# EAGLE schematic n64rgbv1 (EAGLE 8.5.0)
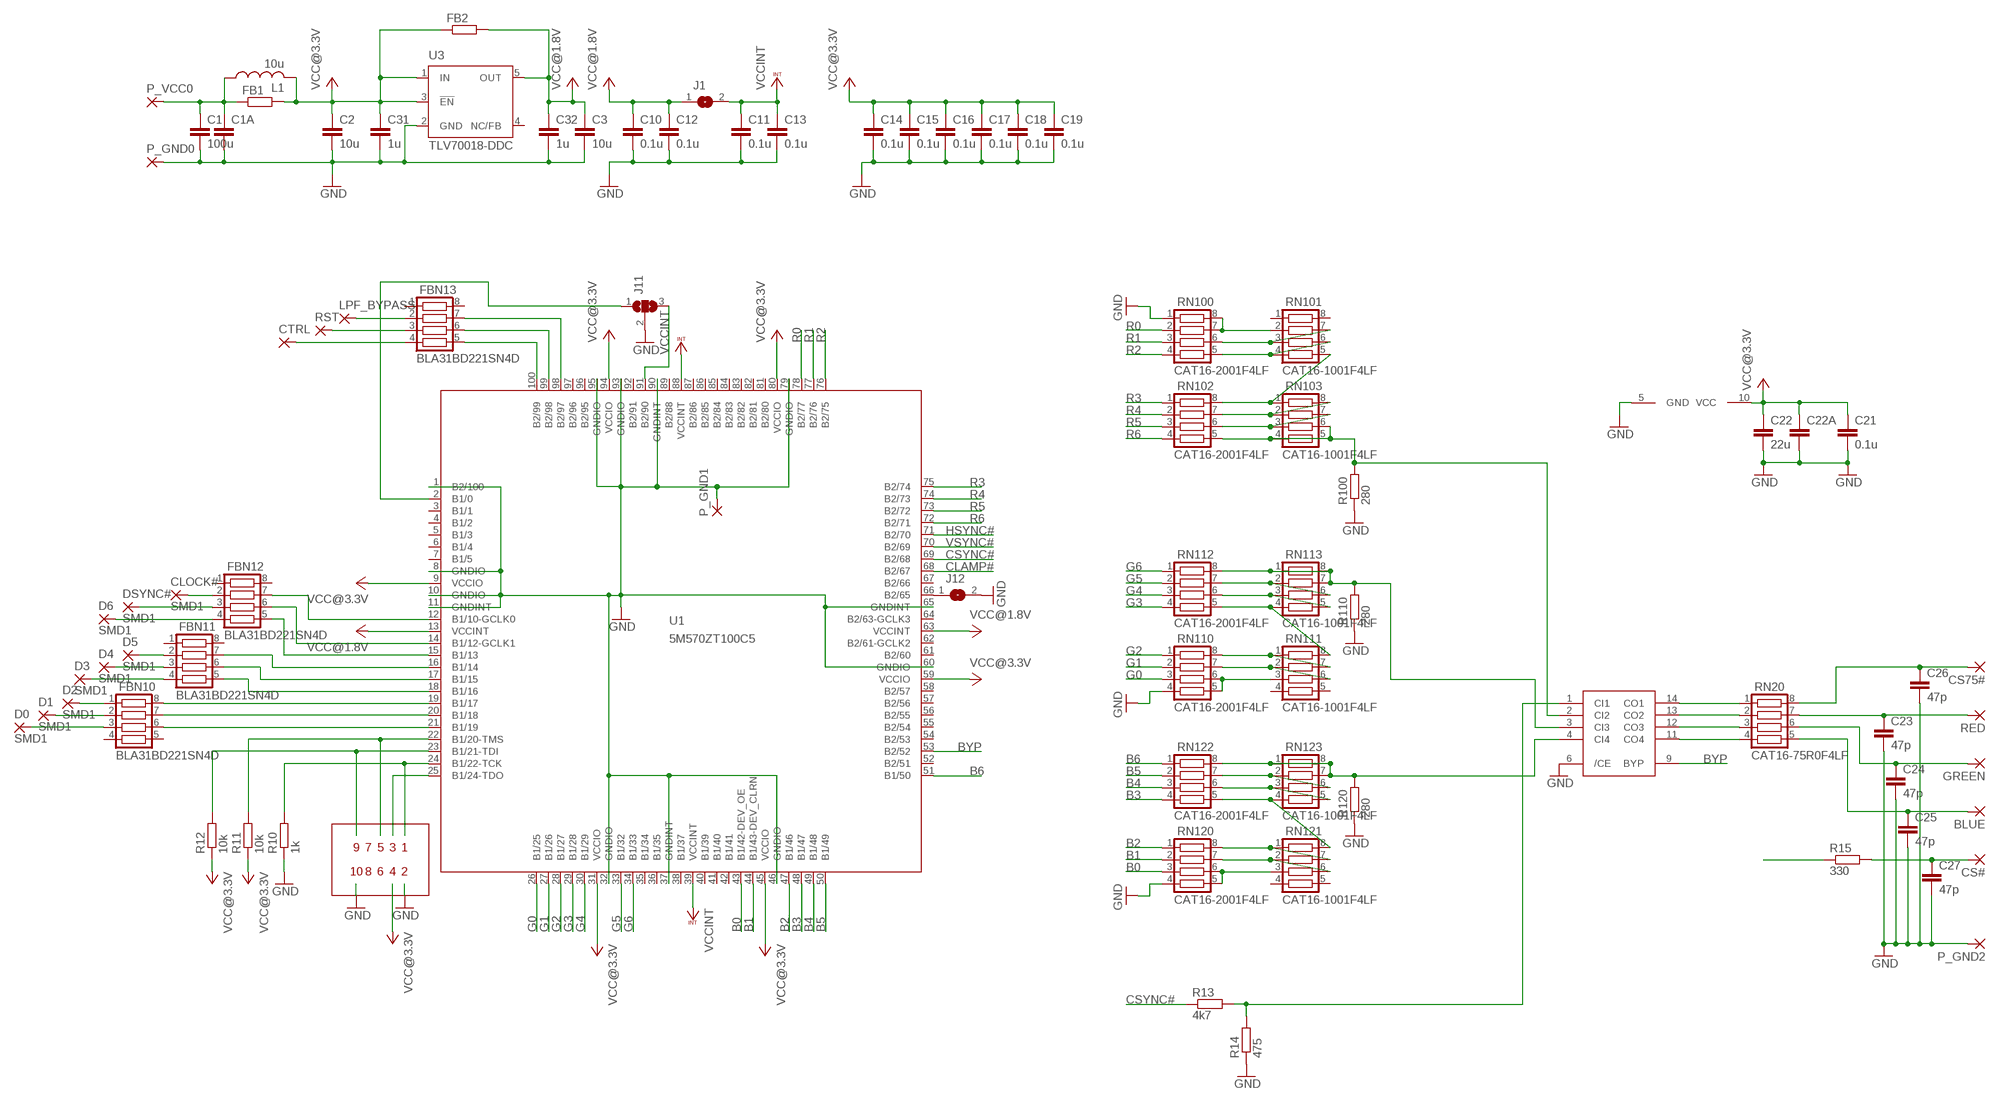
[diagram p0: schematic, sheet 1]

## Parts
BLUE  SMD2  [SMD1,27-2,54]
C1  100u  C-EUC1206K  [C1206K]
C1A  C-EUC0805  [C0805]
C2  10u  C-EUC0805  [C0805]
C3  10u  C-EUC0805  [C0805]
C10  0.1u  C-EUC0603  [C0603]
C11  0.1u  C-EUC0603  [C0603]
C12  0.1u  C-EUC0603  [C0603]
C13  0.1u  C-EUC0603  [C0603]
C14  0.1u  C-EUC0603  [C0603]
C15  0.1u  C-EUC0603  [C0603]
C16  0.1u  C-EUC0603  [C0603]
C17  0.1u  C-EUC0603  [C0603]
C18  0.1u  C-EUC0603  [C0603]
C19  0.1u  C-EUC0603  [C0603]
C21  0.1u  C-EUC0603  [C0603]
C22  22u  C-EUC1206K  [C1206K]
C22A  C-EUC0805  [C0805]
C23  47p  C-EUC0603  [C0603]
C24  47p  C-EUC0603  [C0603]
C25  47p  C-EUC0603  [C0603]
C26  47p  C-EUC0603  [C0603]
C27  47p  C-EUC0603  [C0603]
C31  1u  C-EUC0603  [C0603]
C32  1u  C-EUC0603  [C0603]
CLOCK#  SMD1  [SMD0,8-1,6]
CS75#  SMD2  [SMD1,27-2,54]
CS#  SMD2  [SMD1,27-2,54]
CTRL  SMD2  [SMD1,27-2,54]
D0  SMD1  [SMD0,8-1,6]
D1  SMD1  [SMD0,8-1,6]
D2  SMD1  [SMD0,8-1,6]
D3  SMD1  [SMD0,8-1,6]
D4  SMD1  [SMD0,8-1,6]
D5  SMD1  [SMD0,8-1,6]
D6  SMD1  [SMD0,8-1,6]
DSYNC#  SMD1  [SMD0,8-1,6]
FB1  R-EU_R0603  [R0603]
FB2  R-EU_R0603  [R0603]
FBN10  BLA31BD221SN4D  CTS742C083  [CTS742C083]
FBN11  BLA31BD221SN4D  CTS742C083  [CTS742C083]
FBN12  BLA31BD221SN4D  CTS742C083  [CTS742C083]
FBN13  BLA31BD221SN4D  CTS742C083  [CTS742C083]
GREEN  SMD2  [SMD1,27-2,54]
J1  SJ  [SJ]
J11  SJ2W  [SJ_2]
J12  SJ  [SJ]
L1  10u  L-USL3230M  [L3230M]
LPF_BYPASS  SMD2  [SMD1,27-2,54]
P_GND0  SMD2  [SMD1,27-2,54]
P_GND1  SMD2  [SMD1,27-2,54]
P_GND2  SMD2  [SMD1,27-2,54]
P_VCC0  SMD2  [SMD1,27-2,54]
R10  1k  R-EU_R0603  [R0603]
R11  10k  R-EU_R0603  [R0603]
R12  10k  R-EU_R0603  [R0603]
R13  4k7  R-EU_R0603  [R0603]
R14  475  R-EU_R0603  [R0603]
R15  330  R-EU_R0603  [R0603]
R100  280  R-EU_R0603  [R0603]
R110  280  R-EU_R0603  [R0603]
R120  280  R-EU_R0603  [R0603]
RED  SMD2  [SMD1,27-2,54]
RN20  CAT16-75R0F4LF  CTS742C083  [CTS742C083]
RN100  CAT16-2001F4LF  CTS742C083  [CTS742C083]
RN101  CAT16-1001F4LF  CTS742C083  [CTS742C083]
RN102  CAT16-2001F4LF  CTS742C083  [CTS742C083]
RN103  CAT16-1001F4LF  CTS742C083  [CTS742C083]
RN110  CAT16-2001F4LF  CTS742C083  [CTS742C083]
RN111  CAT16-1001F4LF  CTS742C083  [CTS742C083]
RN112  CAT16-2001F4LF  CTS742C083  [CTS742C083]
RN113  CAT16-1001F4LF  CTS742C083  [CTS742C083]
RN120  CAT16-2001F4LF  CTS742C083  [CTS742C083]
RN121  CAT16-1001F4LF  CTS742C083  [CTS742C083]
RN122  CAT16-2001F4LF  CTS742C083  [CTS742C083]
RN123  CAT16-1001F4LF  CTS742C083  [CTS742C083]
RST  SMD2  [SMD1,27-2,54]
U1  5M570ZT100C5  [TQFP100]
U2  THS7374  [THS7374]
U3  TLV70018-DDC  TPS77018  [SOT23-DBV]

## Nets
B0: RN120.3 U1.43(B1/42-DEV_OE)
B1: RN120.2 U1.44(B1/43-DEV_CLRN)
B2: RN120.1 U1.47(B1/46)
B3: RN122.4 U1.48(B1/47)
B4: RN122.3 U1.49(B1/48)
B5: RN122.2 U1.50(B1/49)
B6: RN122.1 U1.51(B1/50)
BYP: U1.53(B2/52) U2.9(BYP)
CLAMP#: U1.68(B2/67)
CSYNC#: R13.1 R15.1 U1.69(B2/68)
G0: RN110.3 U1.26(B1/25)
G1: RN110.2 U1.27(B1/26)
G2: RN110.1 U1.28(B1/27)
G3: RN112.4 U1.29(B1/28)
G4: RN112.3 U1.30(B1/29)
G5: RN112.2 U1.33(B1/32)
G6: RN112.1 U1.34(B1/33)
GND: C1.2 C1A.2 C2.2 C3.2 C10.2 C11.2 C12.2 C13.2 C14.2 C15.2 C16.2 C17.2 C18.2 C19.2 C21.2 C22.2 C22A.2 C23.2 C24.2 C25.2 C26.2 C27.2 C31.2 C32.2 J11.2 J12.2 P_GND0.1(P) P_GND1.1(P) P_GND2.1(P) R10.1 R14.1 R100.1 R110.1 R120.1 RN100.1 RN110.4 RN120.4 U1.1(B2/100) U1.8(GNDIO) U1.10(GNDIO) U1.11(GNDINT) U1.32(GNDIO) U1.37(GNDINT) U1.46(GNDIO) U1.60(GNDIO) U1.65(GNDINT) U1.79(GNDIO) U1.90(GNDINT) U1.93(GNDIO) U1.95(GNDIO) U2.5(GND) U2.6(/CE) U3.2(GND)
HSYNC#: U1.71(B2/70)
N$1: R13.2 R14.2 U2.1(CI1)
N$2: C23.1 RED.1(P) RN20.7
N$3: RN20.1 U2.14(CO1)
N$4: RN20.2 U2.13(CO2)
N$5: RN20.3 U2.12(CO3)
N$6: RN20.4 U2.11(CO4)
N$7: CTRL.1(P) FBN13.4
N$8: FBN13.3 RST.1(P)
N$9: FBN13.2 LPF_BYPASS.1(P)
N$10: C24.1 GREEN.1(P) RN20.6
N$11: BLUE.1(P) C25.1 RN20.5
N$12: C26.1 CS75#.1(P) RN20.8
N$13: C27.1 CS#.1(P) R15.2
N$14: FBN13.5 U1.100(B2/99)
N$15: D1.P$1(P) FBN10.2
N$16: D0.P$1(P) FBN10.3
N$17: D2.P$1(P) FBN10.1
N$18: FBN10.6 U1.21(B1/19)
N$19: FBN10.7 U1.20(B1/18)
N$20: FBN10.8 U1.19(B1/17)
N$21: D3.P$1(P) FBN11.4
N$22: D4.P$1(P) FBN11.3
N$23: D5.P$1(P) FBN11.2
N$24: D6.P$1(P) FBN12.4
N$25: RN110.5 RN110.6 RN111.3
N$26: RN110.7 RN111.2 RN111.6
N$27: RN110.8 RN111.1 RN111.7
N$28: RN111.8 RN112.5 RN113.4
N$29: RN112.6 RN113.3 RN113.5
N$30: RN112.7 RN113.2 RN113.6
N$31: R120.2 RN122.8 RN123.1 RN123.7 RN123.8 U2.4(CI4)
N$32: RN120.5 RN120.6 RN121.3
N$33: RN120.7 RN121.2 RN121.6
N$34: RN120.8 RN121.1 RN121.7
N$35: RN121.8 RN122.5 RN123.4
N$36: DSYNC#.P$1(P) FBN12.3
N$37: RN122.6 RN123.3 RN123.5
N$38: RN122.7 RN123.2 RN123.6
N$39: CLOCK#.P$1(P) FBN12.2
N$40: FBN11.5 U1.18(B1/16)
N$41: FBN11.6 U1.17(B1/15)
N$42: FBN11.7 U1.16(B1/14)
N$43: FBN12.5 U1.15(B1/13)
N$44: FBN12.6 U1.14(B1/12-GCLK1)
N$45: FBN12.7 U1.12(B1/10-GCLK0)
N$46: FBN13.6 U1.99(B2/98)
N$47: FBN13.7 U1.98(B2/97)
N$48: R100.2 RN102.5 RN103.4 RN103.5 RN103.6 U2.2(CI2)
N$49: J12.1 U1.66(B2/65)
N$51: J11.3 U1.91(B2/90)
N$52: J11.1 U1.2(B1/0)
N$54: C1.1 C1A.1 FB1.1 L1.1 P_VCC0.1(P)
N$76: R110.2 RN112.8 RN113.1 RN113.7 RN113.8 U2.3(CI3)
N$77: RN100.7 RN100.8 RN101.2
N$78: RN100.6 RN101.3 RN101.7
N$79: RN100.5 RN101.4 RN101.6
N$80: RN101.5 RN102.8 RN103.1
N$81: RN102.7 RN103.2 RN103.8
N$82: RN102.6 RN103.3 RN103.7
R0: RN100.2 U1.78(B2/77)
R1: RN100.3 U1.77(B2/76)
R2: RN100.4 U1.76(B2/75)
R3: RN102.1 U1.75(B2/74)
R4: RN102.2 U1.74(B2/73)
R5: RN102.3 U1.73(B2/72)
R6: RN102.4 U1.72(B2/71)
TCK: R10.2 U1.24(B1/22-TCK)
TDI: R12.2 U1.23(B1/21-TDI)
TDO: U1.25(B1/24-TDO)
TMS: R11.2 U1.22(B1/20-TMS)
VCC@1.8V: C3.1 C10.1 C12.1 C32.1 FB2.2 J1.1 U1.13(VCCINT) U1.63(VCCINT) U3.5(OUT)
VCC@3.3V: C2.1 C14.1 C15.1 C16.1 C17.1 C18.1 C19.1 C21.1 C22.1 C22A.1 C31.1 FB1.2 FB2.1 L1.2 R11.1 R12.1 U1.9(VCCIO) U1.31(VCCIO) U1.45(VCCIO) U1.59(VCCIO) U1.80(VCCIO) U1.94(VCCIO) U2.10(VCC) U3.1(IN) U3.3(!EN)
VCCINT: C11.1 C13.1 J1.2 U1.39(VCCINT) U1.88(VCCINT)
VSYNC#: U1.70(B2/69)
Unconnected: FBN10.4 FBN10.5 FBN11.1 FBN11.8 FBN12.1 FBN12.8 FBN13.1 FBN13.8 RN101.1 RN101.8 RN111.4 RN111.5 RN121.4 RN121.5 U1.3(B1/1) U1.4(B1/2) U1.5(B1/3) U1.6(B1/4) U1.7(B1/5) U1.35(B1/34) U1.36(B1/35) U1.38(B1/37) U1.40(B1/39) U1.41(B1/40) U1.42(B1/41) U1.52(B2/51) U1.54(B2/53) U1.55(B2/54) U1.56(B2/55) U1.57(B2/56) U1.58(B2/57) U1.61(B2/60) U1.62(B2/61-GCLK2) U1.64(B2/63-GCLK3) U1.67(B2/66) U1.81(B2/80) U1.82(B2/81) U1.83(B2/82) U1.84(B2/83) U1.85(B2/84) U1.86(B2/85) U1.87(B2/86) U1.89(B2/88) U1.92(B2/91) U1.96(B2/95) U1.97(B2/96) U3.4(NC/FB)

## Notes on the sheet
- 9 | 7 | 5 | 3 | 1
- 10 | 8 | 6 | 4 | 2

## Library data of the parts
BLUE CS75# CS# CTRL GREEN LPF_BYPASS P_GND0 P_GND1 P_GND2 P_VCC0 RED RST = wirepad:SMD2: SMD PAD
C1 C1A C2 C3 C10-C19 C21 C22 C22A C23-C27 C31 C32 = rcl:C-EU: CAPACITOR, European symbol
CLOCK# D0 D1-D6 DSYNC# = wirepad:SMD1
FB1 FB2 R10-R15 R100 R110 R120 = rcl:R-EU_: RESISTOR, European symbol
FBN10-FBN13 RN20 RN100-RN103 RN110-RN113 RN120-RN123 = resistor-net:CTS742C083: Chip Resistor Array 4 Single Resistor Source: http://www.ctscorp.com/components/Datasheets/CTSChipArrayDs.pdf; OC_FARNELL: unknown; OC_NEWARK: unknown
J1 J12 = jumper:SJ: SMD solder JUMPER
J11 = jumper:SJ2W: SMD solder JUMPER
L1 = rcl:L-US: INDUCTOR, American symbol
U1 = altera:5M570ZT100C5
U2 = snes_div:THS7374
U3 = texas:TPS770*: ULTRALOW-POWER 50-mA LOW-DROPOUT LINEAR REGULATORS 50-mA Low-Dropout Regulator Source: http://focus.ti.com/lit/ds/symlink/tps77001.pdf; MF: TEXAS INSTRUMENT CONNECTORS; MPN: TPS77018DBVR; OC_FARNELL: 1575745; OC_NEWARK: 77C1176